# EAGLE design strombegrenzung_npn (EAGLE 9.3.2)
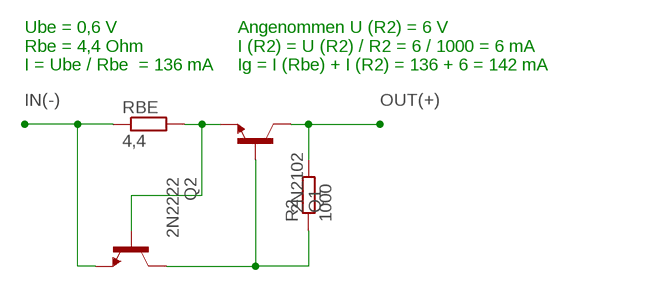
[diagram p0: schematic, sheet 1]

## Parts
Q1  2N2102  [TO5]
Q2  2N2222  [TO18]
R2  1000  R-EU_0207/10  [0207/10]
RBE  4,4  R-EU_0207/7  [0207/7]

## Nets
IN(-): Q2.1(E) RBE.1
N$1: Q1.1(E) Q2.2(B) RBE.2
N$3: Q1.2(B) Q2.3(C) R2.1
OUT(+): Q1.3(C) R2.2

## Notes on the sheet
- Ube = 0,6 V
  Rbe = 4,4 Ohm
  I = Ube / Rbe  = 136 mA
- Angenommen U (R2) = 6 V
  I (R2) = U (R2) / R2 = 6 / 1000 = 6 mA
  Ig = I (Rbe) + I (R2) = 136 + 6 = 142 mA

## Library data of the parts
Q1 = transistor-npn:2N2102: NPN Transistor
Q2 = transistor:2N2222: NPN TRANSISTOR
R2 RBE = rcl:R-EU_: RESISTOR, European symbol; SPICEPREFIX: R

## Board
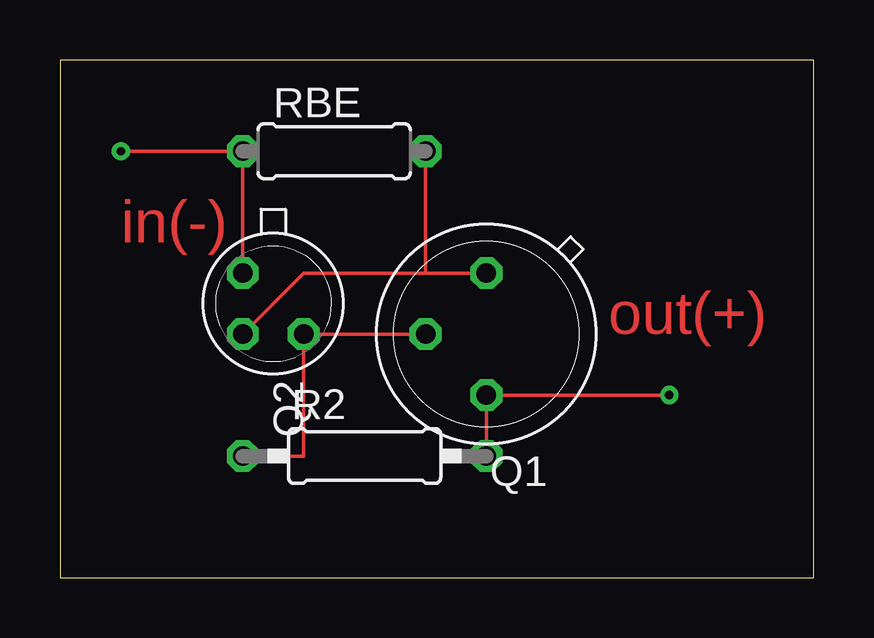
[diagram p1: board, top side]

Size 31.42 x 21.58 mm. Coordinates in mm from the lower left corner, seen from the top.
Outline: 0,0 31.42,0 31.42,21.58 0,21.58 0,0
Copper layers (1*16): Top 0.035mm / dielectric 1.5mm / Bottom 0.035mm
Design rules "default": minimum track width 6mil, minimum drill 0.35mm, track to track 6mil, track to pad 6mil, pad to pad 6mil, via to via 6mil, smd to smd 6mil, copper to edge 40mil, drill to drill 6mil, minimum pad ring 10mil, minimum via ring 8mil, stop-mask expansion 4mil, vias tented up to drill 0mil, thermal gap 10mil

### Footprints (pad centres in the part's own frame; a part is rotated, then mirrored left to right if it is on the bottom)
TO5 = drill 0.813 octagon: 1 0,-2.54; 2 2.54,0; 3 0,2.54
TO18 = drill 0.813 octagon: 1 -1.27,-1.27; 2 1.27,-1.27; 3 1.27,1.27
0207/10 = drill 0.813 octagon: 1 -5.08,0; 2 5.08,0
0207/7 = drill 0.813 octagon: 1 -3.81,0; 2 3.81,0

### Placement (x,y rotation side)
Q1  17.78,10.16 180 top
Q2  8.89,11.43 270 top
R2  12.7,5.08 0 top
RBE  11.43,17.78 0 top

### Tracks (layer width: path | path; a pad name or v marks a point on that pad's centre or on a via)
IN(-)  (via drill 0.35)
  Top 0.152: Q2.1 RBE.1 v2.54,17.78
N$1
  Top 0.152: RBE.2 15.24,12.7 | 15.24,12.7 Q1.1 | Q2.2 10.16,12.7 15.24,12.7
N$3
  Top 0.152: R2.1 10.16,5.08 Q2.3 Q1.2
OUT(+)  (via drill 0.35)
  Top 0.152: R2.2 Q1.3 v25.4,7.62

### Text on the board
Top: in(-) | out(+)